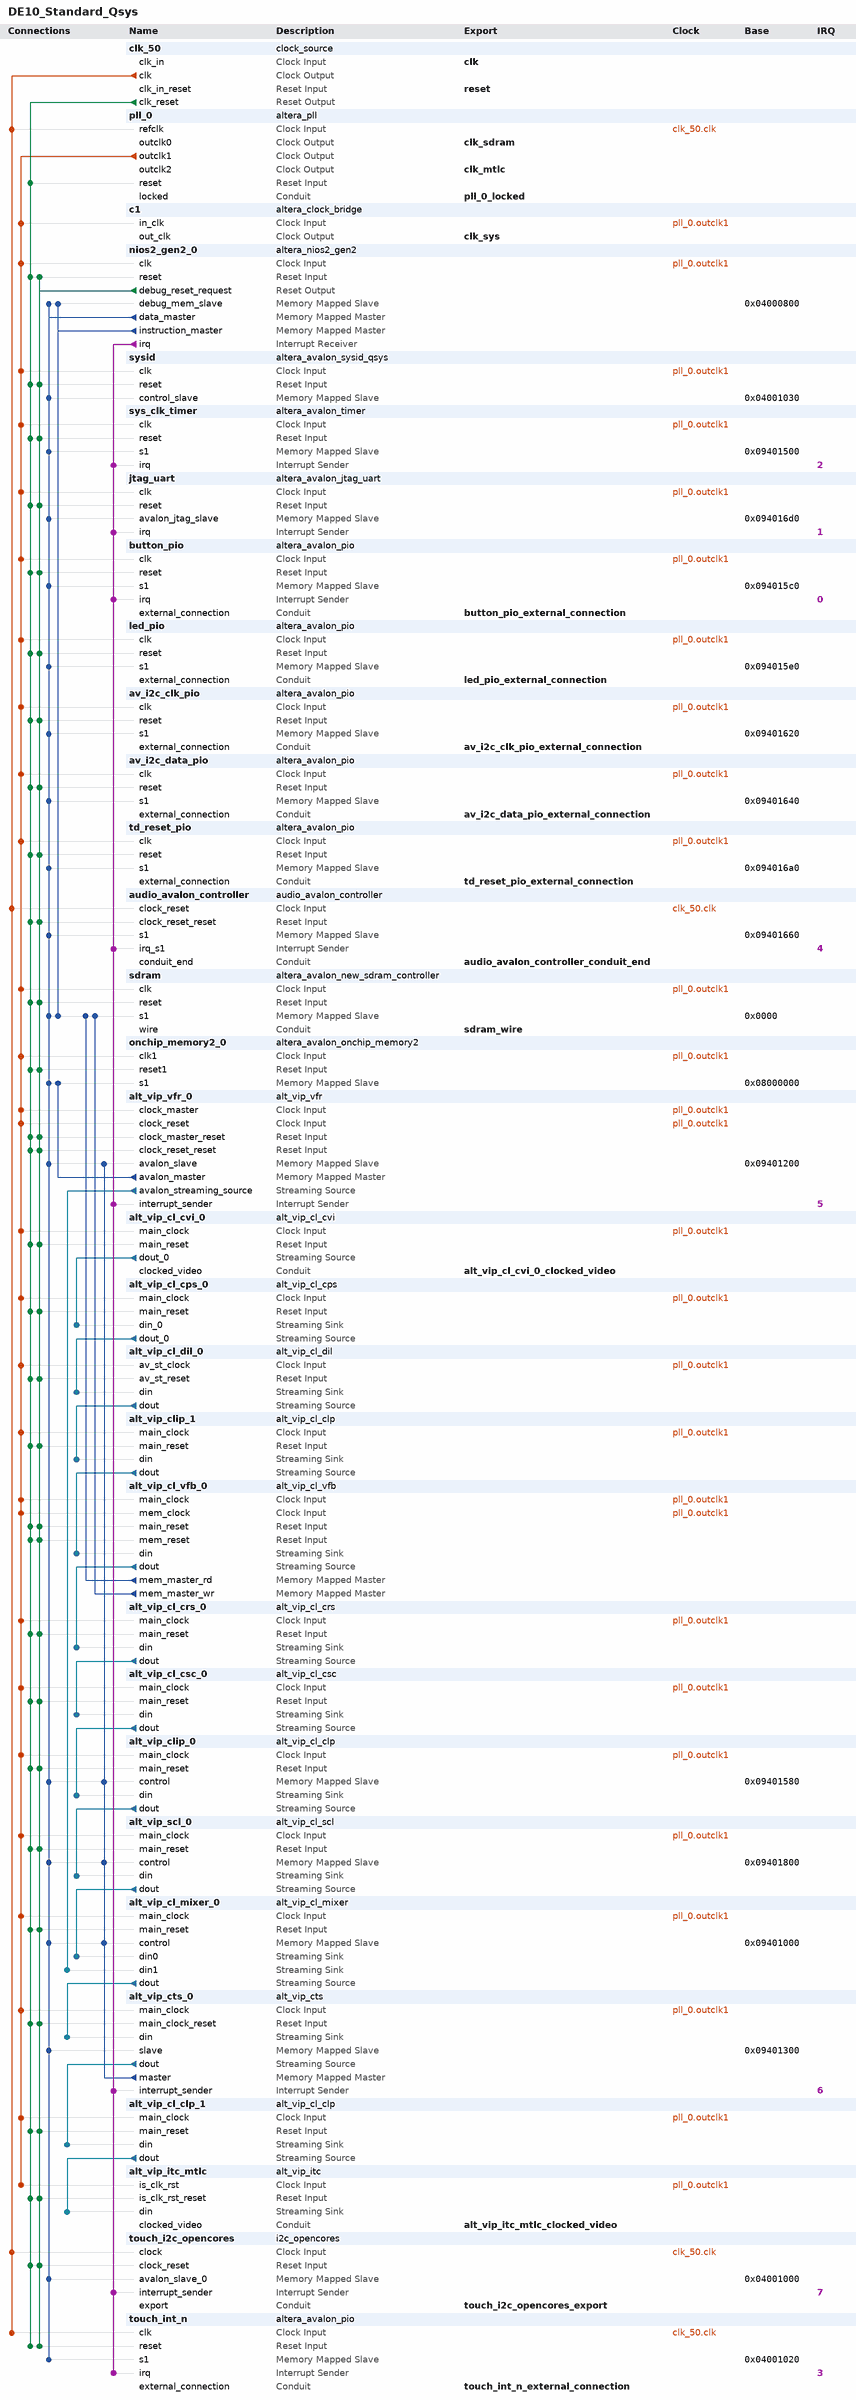
[diagram p0: system contents]
# Platform Designer (Qsys) system DE10_Standard_Qsys, Cyclone V 5CSXFC6D6F31C6
# Parameters at their usual value, and those the tool derives, are not listed.
package require -exact qsys 16.1
create_system DE10_Standard_Qsys
set_project_property DEVICE_FAMILY {Cyclone V}
set_project_property DEVICE 5CSXFC6D6F31C6

add_instance clk_50 clock_source 16.1
set_instance_parameter_value clk_50 clockFrequency 50000000

add_instance pll_0 altera_pll 16.1
set_instance_parameter_value pll_0 gui_device_speed_grade 1
set_instance_parameter_value pll_0 gui_number_of_clocks 3
set_instance_parameter_value pll_0 gui_operation_mode direct
set_instance_parameter_value pll_0 gui_output_clock_frequency0 120.0
set_instance_parameter_value pll_0 gui_output_clock_frequency1 120.0
set_instance_parameter_value pll_0 gui_output_clock_frequency2 33.33333
set_instance_parameter_value pll_0 gui_phase_shift0 -5100
set_instance_parameter_value pll_0 gui_pll_mode {Integer-N PLL}
set_instance_parameter_value pll_0 gui_reference_clock_frequency 50.0
set_instance_parameter_value pll_0 gui_use_locked true

add_instance c1 altera_clock_bridge 16.1
set_instance_parameter_value c1 DERIVED_CLOCK_RATE 120000000
set_instance_parameter_value c1 EXPLICIT_CLOCK_RATE 0

add_instance nios2_gen2_0 altera_nios2_gen2 16.1
set_instance_parameter_value nios2_gen2_0 dcache_size 0
set_instance_parameter_value nios2_gen2_0 exceptionSlave sdram.s1
set_instance_parameter_value nios2_gen2_0 icache_size 4096
set_instance_parameter_value nios2_gen2_0 impl Fast
set_instance_parameter_value nios2_gen2_0 resetSlave sdram.s1

add_instance sysid altera_avalon_sysid_qsys 16.1
set_instance_parameter_value sysid id 0

add_instance sys_clk_timer altera_avalon_timer 16.1
set_instance_parameter_value sys_clk_timer period 10.0
set_instance_parameter_value sys_clk_timer periodUnits MSEC

add_instance jtag_uart altera_avalon_jtag_uart 16.1
set_instance_parameter_value jtag_uart readBufferDepth 256
set_instance_parameter_value jtag_uart readIRQThreshold 4
set_instance_parameter_value jtag_uart simInteractiveOptions INTERACTIVE_ASCII_OUTPUT
set_instance_parameter_value jtag_uart writeBufferDepth 256
set_instance_parameter_value jtag_uart writeIRQThreshold 4

add_instance button_pio altera_avalon_pio 16.1
set_instance_parameter_value button_pio captureEdge true
set_instance_parameter_value button_pio direction Input
set_instance_parameter_value button_pio generateIRQ true
set_instance_parameter_value button_pio irqType EDGE
set_instance_parameter_value button_pio simDoTestBenchWiring true
set_instance_parameter_value button_pio simDrivenValue 15
set_instance_parameter_value button_pio width 4

add_instance led_pio altera_avalon_pio 16.1
set_instance_parameter_value led_pio direction Output
set_instance_parameter_value led_pio width 4

add_instance av_i2c_clk_pio altera_avalon_pio 16.1
set_instance_parameter_value av_i2c_clk_pio direction Output
set_instance_parameter_value av_i2c_clk_pio width 1

add_instance av_i2c_data_pio altera_avalon_pio 16.1
set_instance_parameter_value av_i2c_data_pio direction Bidir
set_instance_parameter_value av_i2c_data_pio simDoTestBenchWiring true
set_instance_parameter_value av_i2c_data_pio width 1

add_instance td_reset_pio altera_avalon_pio 16.1
set_instance_parameter_value td_reset_pio direction Output
set_instance_parameter_value td_reset_pio width 1

add_instance audio_avalon_controller audio_avalon_controller 2.0

add_instance sdram altera_avalon_new_sdram_controller 16.1
set_instance_parameter_value sdram TAC 5.5
set_instance_parameter_value sdram TRCD 20.0
set_instance_parameter_value sdram TRP 20.0
set_instance_parameter_value sdram casLatency 3
set_instance_parameter_value sdram columnWidth 10
set_instance_parameter_value sdram dataWidth 16
set_instance_parameter_value sdram generateSimulationModel true
set_instance_parameter_value sdram model custom
set_instance_parameter_value sdram numberOfBanks 4
set_instance_parameter_value sdram numberOfChipSelects 1
set_instance_parameter_value sdram powerUpDelay 100.0
set_instance_parameter_value sdram refreshPeriod 15.625
set_instance_parameter_value sdram rowWidth 13

add_instance onchip_memory2_0 altera_avalon_onchip_memory2 16.1
set_instance_parameter_value onchip_memory2_0 dataWidth 32
set_instance_parameter_value onchip_memory2_0 dualPort false
set_instance_parameter_value onchip_memory2_0 initMemContent true
set_instance_parameter_value onchip_memory2_0 initializationFileName onchip_mem.hex
set_instance_parameter_value onchip_memory2_0 memorySize 131072

add_instance alt_vip_vfr_0 alt_vip_vfr 14.0
set_instance_parameter_value alt_vip_vfr_0 CLOCKS_ARE_SEPARATE 0
set_instance_parameter_value alt_vip_vfr_0 MAX_IMAGE_HEIGHT 480
set_instance_parameter_value alt_vip_vfr_0 MAX_IMAGE_WIDTH 800
set_instance_parameter_value alt_vip_vfr_0 MEM_PORT_WIDTH 32
set_instance_parameter_value alt_vip_vfr_0 NUMBER_OF_CHANNELS_IN_PARALLEL 3
set_instance_parameter_value alt_vip_vfr_0 RMASTER_BURST_TARGET 64
set_instance_parameter_value alt_vip_vfr_0 RMASTER_FIFO_DEPTH 1024

add_instance alt_vip_cl_cvi_0 alt_vip_cl_cvi 16.1
set_instance_parameter_value alt_vip_cl_cvi_0 ACCEPT_COLOURS_IN_SEQ 0
set_instance_parameter_value alt_vip_cl_cvi_0 ANC_DEPTH 1
set_instance_parameter_value alt_vip_cl_cvi_0 BPS 8
set_instance_parameter_value alt_vip_cl_cvi_0 CLOCKS_ARE_SAME 0
set_instance_parameter_value alt_vip_cl_cvi_0 COLOUR_PLANES_ARE_IN_PARALLEL 0
set_instance_parameter_value alt_vip_cl_cvi_0 EXTRACT_TOTAL_RESOLUTION 1
set_instance_parameter_value alt_vip_cl_cvi_0 FIFO_DEPTH 2048
set_instance_parameter_value alt_vip_cl_cvi_0 GENERATE_ANC 0
set_instance_parameter_value alt_vip_cl_cvi_0 GENERATE_VID_F 0
set_instance_parameter_value alt_vip_cl_cvi_0 H_ACTIVE_PIXELS_F0 720
set_instance_parameter_value alt_vip_cl_cvi_0 INTERLACED 1
set_instance_parameter_value alt_vip_cl_cvi_0 MATCH_CTRLDATA_PKT_CLIP_BASIC 0
set_instance_parameter_value alt_vip_cl_cvi_0 MATCH_CTRLDATA_PKT_PAD_ADV 0
set_instance_parameter_value alt_vip_cl_cvi_0 NO_OF_CHANNELS 1
set_instance_parameter_value alt_vip_cl_cvi_0 NUMBER_OF_COLOUR_PLANES 2
set_instance_parameter_value alt_vip_cl_cvi_0 OVERFLOW_HANDLING 0
set_instance_parameter_value alt_vip_cl_cvi_0 PIXELS_IN_PARALLEL 1
set_instance_parameter_value alt_vip_cl_cvi_0 STD_WIDTH 1
set_instance_parameter_value alt_vip_cl_cvi_0 SYNC_TO 0
set_instance_parameter_value alt_vip_cl_cvi_0 USE_CONTROL 0
set_instance_parameter_value alt_vip_cl_cvi_0 USE_EMBEDDED_SYNCS 1
set_instance_parameter_value alt_vip_cl_cvi_0 USE_HDMI_DEPRICATION 0
set_instance_parameter_value alt_vip_cl_cvi_0 USE_STD 0
set_instance_parameter_value alt_vip_cl_cvi_0 V_ACTIVE_LINES_F0 288
set_instance_parameter_value alt_vip_cl_cvi_0 V_ACTIVE_LINES_F1 288

add_instance alt_vip_cl_cps_0 alt_vip_cl_cps 16.1
set_instance_parameter_value alt_vip_cl_cps_0 BITS_PER_SYMBOL 8
set_instance_parameter_value alt_vip_cl_cps_0 EXTRA_PIPELINING 0
set_instance_parameter_value alt_vip_cl_cps_0 INPUT_0_COLOR_PLANES_ARE_IN_PARALLEL 0
set_instance_parameter_value alt_vip_cl_cps_0 INPUT_0_FIFO 0
set_instance_parameter_value alt_vip_cl_cps_0 INPUT_0_FIFO_SIZE 128
set_instance_parameter_value alt_vip_cl_cps_0 INPUT_0_NUMBER_OF_COLOR_PLANES 2
set_instance_parameter_value alt_vip_cl_cps_0 INPUT_0_PATTERN C,Y
set_instance_parameter_value alt_vip_cl_cps_0 INPUT_0_PIXELS_IN_PARALLEL 1
set_instance_parameter_value alt_vip_cl_cps_0 INPUT_0_TWO_PIXELS_PATTERN 0
set_instance_parameter_value alt_vip_cl_cps_0 INPUT_1_COLOR_PLANES_ARE_IN_PARALLEL 1
set_instance_parameter_value alt_vip_cl_cps_0 INPUT_1_FIFO 0
set_instance_parameter_value alt_vip_cl_cps_0 INPUT_1_FIFO_SIZE 8
set_instance_parameter_value alt_vip_cl_cps_0 INPUT_1_NUMBER_OF_COLOR_PLANES 3
set_instance_parameter_value alt_vip_cl_cps_0 INPUT_1_PATTERN C0,C1,C2
set_instance_parameter_value alt_vip_cl_cps_0 INPUT_1_PIXELS_IN_PARALLEL 1
set_instance_parameter_value alt_vip_cl_cps_0 INPUT_1_TWO_PIXELS_PATTERN 0
set_instance_parameter_value alt_vip_cl_cps_0 INPUT_VALIDATION 1
set_instance_parameter_value alt_vip_cl_cps_0 NUMBER_OF_INPUTS 1
set_instance_parameter_value alt_vip_cl_cps_0 NUMBER_OF_OUTPUTS 1
set_instance_parameter_value alt_vip_cl_cps_0 OUTPUT_0_COLOR_PLANES_ARE_IN_PARALLEL 1
set_instance_parameter_value alt_vip_cl_cps_0 OUTPUT_0_FIFO 0
set_instance_parameter_value alt_vip_cl_cps_0 OUTPUT_0_FIFO_SIZE 128
set_instance_parameter_value alt_vip_cl_cps_0 OUTPUT_0_NUMBER_OF_COLOR_PLANES 2
set_instance_parameter_value alt_vip_cl_cps_0 OUTPUT_0_PATTERN C,Y
set_instance_parameter_value alt_vip_cl_cps_0 OUTPUT_0_PIXELS_IN_PARALLEL 1
set_instance_parameter_value alt_vip_cl_cps_0 OUTPUT_0_TWO_PIXELS_PATTERN 0
set_instance_parameter_value alt_vip_cl_cps_0 OUTPUT_1_COLOR_PLANES_ARE_IN_PARALLEL 1
set_instance_parameter_value alt_vip_cl_cps_0 OUTPUT_1_FIFO 0
set_instance_parameter_value alt_vip_cl_cps_0 OUTPUT_1_FIFO_SIZE 8
set_instance_parameter_value alt_vip_cl_cps_0 OUTPUT_1_NUMBER_OF_COLOR_PLANES 3
set_instance_parameter_value alt_vip_cl_cps_0 OUTPUT_1_PATTERN C0,C1,C2
set_instance_parameter_value alt_vip_cl_cps_0 OUTPUT_1_PIXELS_IN_PARALLEL 1
set_instance_parameter_value alt_vip_cl_cps_0 OUTPUT_1_TWO_PIXELS_PATTERN 0
set_instance_parameter_value alt_vip_cl_cps_0 OUTPUT_VALIDATION 1
set_instance_parameter_value alt_vip_cl_cps_0 USER_PACKET_SUPPORT PASSTHROUGH
set_instance_parameter_value alt_vip_cl_cps_0 USER_PKT_0_TO_0 1
set_instance_parameter_value alt_vip_cl_cps_0 USER_PKT_0_TO_1 0
set_instance_parameter_value alt_vip_cl_cps_0 USER_PKT_1_TO_0 0
set_instance_parameter_value alt_vip_cl_cps_0 USER_PKT_1_TO_1 1

add_instance alt_vip_cl_dil_0 alt_vip_cl_dil 16.1
set_instance_parameter_value alt_vip_cl_dil_0 BITS_PER_SYMBOL 8
set_instance_parameter_value alt_vip_cl_dil_0 BOB_BEHAVIOUR FRAME_FOR_FIELD
set_instance_parameter_value alt_vip_cl_dil_0 CADENCE_ALGORITHM_NAME CADENCE_32_22_VOF
set_instance_parameter_value alt_vip_cl_dil_0 CADENCE_DETECTION 0
set_instance_parameter_value alt_vip_cl_dil_0 CLOCKS_ARE_SEPARATE 0
set_instance_parameter_value alt_vip_cl_dil_0 COLOR_PLANES_ARE_IN_PARALLEL 1
set_instance_parameter_value alt_vip_cl_dil_0 DEINTERLACE_ALGORITHM BOB
set_instance_parameter_value alt_vip_cl_dil_0 DISABLE_EMBEDDED_STREAM_CLEANER 0
set_instance_parameter_value alt_vip_cl_dil_0 EDI_READ_MASTER_BURST_TARGET 32
set_instance_parameter_value alt_vip_cl_dil_0 EDI_READ_MASTER_FIFO_DEPTH 64
set_instance_parameter_value alt_vip_cl_dil_0 ENABLE_422_PROCESSING_FOR_INTERLACED_VIDEO 1
set_instance_parameter_value alt_vip_cl_dil_0 FAMILY {Cyclone V}
set_instance_parameter_value alt_vip_cl_dil_0 FIELD_LATENCY 0
set_instance_parameter_value alt_vip_cl_dil_0 IS_422 1
set_instance_parameter_value alt_vip_cl_dil_0 IS_YCBCR 1
set_instance_parameter_value alt_vip_cl_dil_0 MAX_HEIGHT 576
set_instance_parameter_value alt_vip_cl_dil_0 MAX_SYMBOLS_PER_PACKET 10
set_instance_parameter_value alt_vip_cl_dil_0 MAX_WIDTH 720
set_instance_parameter_value alt_vip_cl_dil_0 MA_READ_MASTER_BURST_TARGET 32
set_instance_parameter_value alt_vip_cl_dil_0 MA_READ_MASTER_FIFO_DEPTH 64
set_instance_parameter_value alt_vip_cl_dil_0 MEM_BASE_ADDR 0
set_instance_parameter_value alt_vip_cl_dil_0 MEM_PORT_WIDTH 256
set_instance_parameter_value alt_vip_cl_dil_0 MOTION_BLEED 1
set_instance_parameter_value alt_vip_cl_dil_0 MOTION_BPS 7
set_instance_parameter_value alt_vip_cl_dil_0 MOTION_READ_MASTER_BURST_TARGET 32
set_instance_parameter_value alt_vip_cl_dil_0 MOTION_READ_MASTER_FIFO_DEPTH 64
set_instance_parameter_value alt_vip_cl_dil_0 MOTION_WRITE_MASTER_BURST_TARGET 32
set_instance_parameter_value alt_vip_cl_dil_0 MOTION_WRITE_MASTER_FIFO_DEPTH 64
set_instance_parameter_value alt_vip_cl_dil_0 NUMBER_OF_COLOR_PLANES 2
set_instance_parameter_value alt_vip_cl_dil_0 PIXELS_IN_PARALLEL 1
set_instance_parameter_value alt_vip_cl_dil_0 RUNTIME_CONTROL 0
set_instance_parameter_value alt_vip_cl_dil_0 USER_PACKETS_MAX_STORAGE 0
set_instance_parameter_value alt_vip_cl_dil_0 USER_PACKET_FIFO_DEPTH 0
set_instance_parameter_value alt_vip_cl_dil_0 USER_PACKET_SUPPORT PASSTHROUGH
set_instance_parameter_value alt_vip_cl_dil_0 WRITE_MASTER_BURST_TARGET 32
set_instance_parameter_value alt_vip_cl_dil_0 WRITE_MASTER_FIFO_DEPTH 64

add_instance alt_vip_clip_1 alt_vip_cl_clp 16.1
set_instance_parameter_value alt_vip_clip_1 BITS_PER_SYMBOL 8
set_instance_parameter_value alt_vip_clip_1 BOTTOM_OFFSET 10
set_instance_parameter_value alt_vip_clip_1 CLIPPING_METHOD RECTANGLE
set_instance_parameter_value alt_vip_clip_1 COLOR_PLANES_ARE_IN_PARALLEL 1
set_instance_parameter_value alt_vip_clip_1 EXTRA_PIPELINING 0
set_instance_parameter_value alt_vip_clip_1 FAMILY {Cyclone V}
set_instance_parameter_value alt_vip_clip_1 LEFT_OFFSET 0
set_instance_parameter_value alt_vip_clip_1 LIMITED_READBACK 0
set_instance_parameter_value alt_vip_clip_1 MAX_IN_HEIGHT 576
set_instance_parameter_value alt_vip_clip_1 MAX_IN_WIDTH 720
set_instance_parameter_value alt_vip_clip_1 NUMBER_OF_COLOR_PLANES 2
set_instance_parameter_value alt_vip_clip_1 PIXELS_IN_PARALLEL 1
set_instance_parameter_value alt_vip_clip_1 RECTANGLE_HEIGHT 480
set_instance_parameter_value alt_vip_clip_1 RECTANGLE_WIDTH 720
set_instance_parameter_value alt_vip_clip_1 RIGHT_OFFSET 10
set_instance_parameter_value alt_vip_clip_1 RUNTIME_CONTROL 0
set_instance_parameter_value alt_vip_clip_1 TOP_OFFSET 24
set_instance_parameter_value alt_vip_clip_1 USER_PACKET_FIFO_DEPTH 0
set_instance_parameter_value alt_vip_clip_1 USER_PACKET_SUPPORT PASSTHROUGH

add_instance alt_vip_cl_vfb_0 alt_vip_cl_vfb 16.1
set_instance_parameter_value alt_vip_cl_vfb_0 CLOCKS_ARE_SEPARATE 1
set_instance_parameter_value alt_vip_cl_vfb_0 DROP_FRAMES 1
set_instance_parameter_value alt_vip_cl_vfb_0 DROP_INVALID_FIELDS 1
set_instance_parameter_value alt_vip_cl_vfb_0 DROP_REPEAT_USER 1
set_instance_parameter_value alt_vip_cl_vfb_0 IS_FRAME_READER 0
set_instance_parameter_value alt_vip_cl_vfb_0 MAX_HEIGHT 480
set_instance_parameter_value alt_vip_cl_vfb_0 MAX_WIDTH 720
set_instance_parameter_value alt_vip_cl_vfb_0 MEM_BASE_ADDR 16777216
set_instance_parameter_value alt_vip_cl_vfb_0 MEM_BUFFER_OFFSET 16777216
set_instance_parameter_value alt_vip_cl_vfb_0 MEM_PORT_WIDTH 32
set_instance_parameter_value alt_vip_cl_vfb_0 NUMBER_OF_COLOR_PLANES 2
set_instance_parameter_value alt_vip_cl_vfb_0 READER_RUNTIME_CONTROL 0
set_instance_parameter_value alt_vip_cl_vfb_0 READ_BURST_TARGET 64
set_instance_parameter_value alt_vip_cl_vfb_0 READ_FIFO_DEPTH 512
set_instance_parameter_value alt_vip_cl_vfb_0 USER_PACKETS_MAX_STORAGE 0
set_instance_parameter_value alt_vip_cl_vfb_0 USE_BUFFER_OFFSET 0
set_instance_parameter_value alt_vip_cl_vfb_0 WRITE_BURST_TARGET 64
set_instance_parameter_value alt_vip_cl_vfb_0 WRITE_FIFO_DEPTH 512

add_instance alt_vip_cl_crs_0 alt_vip_cl_crs 16.1
set_instance_parameter_value alt_vip_cl_crs_0 BITS_PER_SYMBOL 8
set_instance_parameter_value alt_vip_cl_crs_0 COLOR_PLANES_ARE_IN_PARALLEL 1
set_instance_parameter_value alt_vip_cl_crs_0 ENABLE_420_IN 0
set_instance_parameter_value alt_vip_cl_crs_0 ENABLE_420_OUT 0
set_instance_parameter_value alt_vip_cl_crs_0 ENABLE_422_IN 1
set_instance_parameter_value alt_vip_cl_crs_0 ENABLE_422_OUT 0
set_instance_parameter_value alt_vip_cl_crs_0 ENABLE_444_IN 0
set_instance_parameter_value alt_vip_cl_crs_0 ENABLE_444_OUT 1
set_instance_parameter_value alt_vip_cl_crs_0 HORIZ_ALGORITHM NEAREST_NEIGHBOUR
set_instance_parameter_value alt_vip_cl_crs_0 HORIZ_CO_SITING LEFT
set_instance_parameter_value alt_vip_cl_crs_0 HORIZ_ENABLE_LUMA_ADAPT 0
set_instance_parameter_value alt_vip_cl_crs_0 LIMITED_READBACK 0
set_instance_parameter_value alt_vip_cl_crs_0 MAX_HEIGHT 480
set_instance_parameter_value alt_vip_cl_crs_0 MAX_WIDTH 720
set_instance_parameter_value alt_vip_cl_crs_0 NUMBER_OF_COLOR_PLANES 2
set_instance_parameter_value alt_vip_cl_crs_0 PIPELINE_READY 0
set_instance_parameter_value alt_vip_cl_crs_0 PIP_IN 1
set_instance_parameter_value alt_vip_cl_crs_0 PIP_OUT 1
set_instance_parameter_value alt_vip_cl_crs_0 PIXELS_IN_PARALLEL 1
set_instance_parameter_value alt_vip_cl_crs_0 SHOW_HIDDEN_FEATURES 0
set_instance_parameter_value alt_vip_cl_crs_0 USER_PACKET_FIFO_DEPTH 0
set_instance_parameter_value alt_vip_cl_crs_0 USER_PACKET_SUPPORT PASSTHROUGH
set_instance_parameter_value alt_vip_cl_crs_0 VARIABLE_SIDE NEITHER
set_instance_parameter_value alt_vip_cl_crs_0 VERT_ALGORITHM BILINEAR
set_instance_parameter_value alt_vip_cl_crs_0 VERT_CO_SITING TOP
set_instance_parameter_value alt_vip_cl_crs_0 VERT_ENABLE_LUMA_ADAPT 0

add_instance alt_vip_cl_csc_0 alt_vip_cl_csc 16.1
set_instance_parameter_value alt_vip_cl_csc_0 COEFFICIENT_INT_BITS 2
set_instance_parameter_value alt_vip_cl_csc_0 COEFFICIENT_SIGNED 1
set_instance_parameter_value alt_vip_cl_csc_0 COEF_SUM_FRACTION_BITS 8
set_instance_parameter_value alt_vip_cl_csc_0 COLOR_PLANES_ARE_IN_PARALLEL 1
set_instance_parameter_value alt_vip_cl_csc_0 CONVERSION_MODE LSB
set_instance_parameter_value alt_vip_cl_csc_0 FAMILY {Cyclone V}
set_instance_parameter_value alt_vip_cl_csc_0 INPUT_BITS_PER_SYMBOL 8
set_instance_parameter_value alt_vip_cl_csc_0 INPUT_DATA_TYPE_GUARD_BAND 1
set_instance_parameter_value alt_vip_cl_csc_0 INPUT_DATA_TYPE_MAX 240
set_instance_parameter_value alt_vip_cl_csc_0 INPUT_DATA_TYPE_MIN 16
set_instance_parameter_value alt_vip_cl_csc_0 INPUT_DATA_TYPE_SIGNED 0
set_instance_parameter_value alt_vip_cl_csc_0 LIMITED_READBACK 0
set_instance_parameter_value alt_vip_cl_csc_0 MOVE_BINARY_POINT_RIGHT 0
set_instance_parameter_value alt_vip_cl_csc_0 NUMBER_OF_COLOR_PLANES 3
set_instance_parameter_value alt_vip_cl_csc_0 OUTPUT_BITS_PER_SYMBOL 8
set_instance_parameter_value alt_vip_cl_csc_0 OUTPUT_DATA_TYPE_GUARD_BAND 0
set_instance_parameter_value alt_vip_cl_csc_0 OUTPUT_DATA_TYPE_MAX 255
set_instance_parameter_value alt_vip_cl_csc_0 OUTPUT_DATA_TYPE_MIN 0
set_instance_parameter_value alt_vip_cl_csc_0 OUTPUT_DATA_TYPE_SIGNED 0
set_instance_parameter_value alt_vip_cl_csc_0 PIPELINE_DATA_OUTPUT 0
set_instance_parameter_value alt_vip_cl_csc_0 PIXELS_IN_PARALLEL 1
set_instance_parameter_value alt_vip_cl_csc_0 REMOVE_FRACTION_METHOD 1
set_instance_parameter_value alt_vip_cl_csc_0 REQ_FCOEFF_A0 2.018
set_instance_parameter_value alt_vip_cl_csc_0 REQ_FCOEFF_A1 -0.391
set_instance_parameter_value alt_vip_cl_csc_0 REQ_FCOEFF_A2 0.0
set_instance_parameter_value alt_vip_cl_csc_0 REQ_FCOEFF_B0 0.0
set_instance_parameter_value alt_vip_cl_csc_0 REQ_FCOEFF_B1 -0.813
set_instance_parameter_value alt_vip_cl_csc_0 REQ_FCOEFF_B2 1.596
set_instance_parameter_value alt_vip_cl_csc_0 REQ_FCOEFF_C0 1.164
set_instance_parameter_value alt_vip_cl_csc_0 REQ_FCOEFF_C1 1.164
set_instance_parameter_value alt_vip_cl_csc_0 REQ_FCOEFF_C2 1.164
set_instance_parameter_value alt_vip_cl_csc_0 REQ_FCOEFF_S0 -276.928
set_instance_parameter_value alt_vip_cl_csc_0 REQ_FCOEFF_S1 135.488
set_instance_parameter_value alt_vip_cl_csc_0 REQ_FCOEFF_S2 -222.912
set_instance_parameter_value alt_vip_cl_csc_0 RUNTIME_CONTROL 0
set_instance_parameter_value alt_vip_cl_csc_0 SIGN_TO_UNSIGN_METHOD 0
set_instance_parameter_value alt_vip_cl_csc_0 SUMMAND_INT_BITS 9
set_instance_parameter_value alt_vip_cl_csc_0 SUMMAND_SIGNED 1
set_instance_parameter_value alt_vip_cl_csc_0 USER_PACKET_SUPPORT PASSTHROUGH

add_instance alt_vip_clip_0 alt_vip_cl_clp 16.1
set_instance_parameter_value alt_vip_clip_0 BITS_PER_SYMBOL 8
set_instance_parameter_value alt_vip_clip_0 BOTTOM_OFFSET 10
set_instance_parameter_value alt_vip_clip_0 CLIPPING_METHOD RECTANGLE
set_instance_parameter_value alt_vip_clip_0 COLOR_PLANES_ARE_IN_PARALLEL 1
set_instance_parameter_value alt_vip_clip_0 EXTRA_PIPELINING 0
set_instance_parameter_value alt_vip_clip_0 FAMILY {Cyclone V}
set_instance_parameter_value alt_vip_clip_0 LEFT_OFFSET 0
set_instance_parameter_value alt_vip_clip_0 LIMITED_READBACK 0
set_instance_parameter_value alt_vip_clip_0 MAX_IN_HEIGHT 480
set_instance_parameter_value alt_vip_clip_0 MAX_IN_WIDTH 720
set_instance_parameter_value alt_vip_clip_0 NUMBER_OF_COLOR_PLANES 3
set_instance_parameter_value alt_vip_clip_0 PIXELS_IN_PARALLEL 1
set_instance_parameter_value alt_vip_clip_0 RECTANGLE_HEIGHT 480
set_instance_parameter_value alt_vip_clip_0 RECTANGLE_WIDTH 720
set_instance_parameter_value alt_vip_clip_0 RIGHT_OFFSET 10
set_instance_parameter_value alt_vip_clip_0 RUNTIME_CONTROL 1
set_instance_parameter_value alt_vip_clip_0 TOP_OFFSET 0
set_instance_parameter_value alt_vip_clip_0 USER_PACKET_FIFO_DEPTH 0
set_instance_parameter_value alt_vip_clip_0 USER_PACKET_SUPPORT PASSTHROUGH

add_instance alt_vip_scl_0 alt_vip_cl_scl 16.1
set_instance_parameter_value alt_vip_scl_0 ALGORITHM_NAME BILINEAR
set_instance_parameter_value alt_vip_scl_0 ALWAYS_DOWNSCALE 0
set_instance_parameter_value alt_vip_scl_0 ARE_IDENTICAL 0
set_instance_parameter_value alt_vip_scl_0 BITS_PER_SYMBOL 8
set_instance_parameter_value alt_vip_scl_0 DEFAULT_EDGE_THRESH 7
set_instance_parameter_value alt_vip_scl_0 DEFAULT_LOWER_BLUR 0
set_instance_parameter_value alt_vip_scl_0 DEFAULT_UPPER_BLUR 15
set_instance_parameter_value alt_vip_scl_0 ENABLE_FIR 0
set_instance_parameter_value alt_vip_scl_0 EXTRA_PIPELINING 0
set_instance_parameter_value alt_vip_scl_0 FAMILY {Cyclone V}
set_instance_parameter_value alt_vip_scl_0 H_BANKS 1
set_instance_parameter_value alt_vip_scl_0 H_COEFF_FILE {<enter file name (including full path)>}
set_instance_parameter_value alt_vip_scl_0 H_FRACTION_BITS 7
set_instance_parameter_value alt_vip_scl_0 H_FUNCTION LANCZOS_2
set_instance_parameter_value alt_vip_scl_0 H_INTEGER_BITS 1
set_instance_parameter_value alt_vip_scl_0 H_PHASES 16
set_instance_parameter_value alt_vip_scl_0 H_SIGNED 1
set_instance_parameter_value alt_vip_scl_0 H_SYMMETRIC 0
set_instance_parameter_value alt_vip_scl_0 H_TAPS 8
set_instance_parameter_value alt_vip_scl_0 IS_420 0
set_instance_parameter_value alt_vip_scl_0 IS_422 0
set_instance_parameter_value alt_vip_scl_0 LIMITED_READBACK 0
set_instance_parameter_value alt_vip_scl_0 LOAD_AT_RUNTIME 0
set_instance_parameter_value alt_vip_scl_0 MAX_IN_HEIGHT 480
set_instance_parameter_value alt_vip_scl_0 MAX_IN_WIDTH 720
set_instance_parameter_value alt_vip_scl_0 MAX_OUT_HEIGHT 480
set_instance_parameter_value alt_vip_scl_0 MAX_OUT_WIDTH 800
set_instance_parameter_value alt_vip_scl_0 NO_BLANKING 0
set_instance_parameter_value alt_vip_scl_0 PIXELS_IN_PARALLEL 1
set_instance_parameter_value alt_vip_scl_0 PRESERVE_BITS 0
set_instance_parameter_value alt_vip_scl_0 RUNTIME_CONTROL 1
set_instance_parameter_value alt_vip_scl_0 SYMBOLS_IN_PAR 3
set_instance_parameter_value alt_vip_scl_0 SYMBOLS_IN_SEQ 1
set_instance_parameter_value alt_vip_scl_0 USER_PACKET_FIFO_DEPTH 0
set_instance_parameter_value alt_vip_scl_0 USER_PACKET_SUPPORT PASSTHROUGH
set_instance_parameter_value alt_vip_scl_0 V_BANKS 1
set_instance_parameter_value alt_vip_scl_0 V_COEFF_FILE {<enter file name (including full path)>}
set_instance_parameter_value alt_vip_scl_0 V_FRACTION_BITS 7
set_instance_parameter_value alt_vip_scl_0 V_FUNCTION LANCZOS_2
set_instance_parameter_value alt_vip_scl_0 V_INTEGER_BITS 1
set_instance_parameter_value alt_vip_scl_0 V_PHASES 16
set_instance_parameter_value alt_vip_scl_0 V_SIGNED 1
set_instance_parameter_value alt_vip_scl_0 V_SYMMETRIC 0
set_instance_parameter_value alt_vip_scl_0 V_TAPS 8

add_instance alt_vip_cl_mixer_0 alt_vip_cl_mixer 16.1
set_instance_parameter_value alt_vip_cl_mixer_0 ALPHA_ENABLE 0
set_instance_parameter_value alt_vip_cl_mixer_0 ALPHA_STREAMS_ENABLE 0
set_instance_parameter_value alt_vip_cl_mixer_0 BITS_PER_SYMBOL 8
set_instance_parameter_value alt_vip_cl_mixer_0 COLOR_PLANES_ARE_IN_PARALLEL 1
set_instance_parameter_value alt_vip_cl_mixer_0 COLOR_SPACE RGB
set_instance_parameter_value alt_vip_cl_mixer_0 FAMILY {Cyclone V}
set_instance_parameter_value alt_vip_cl_mixer_0 IS_422 1
set_instance_parameter_value alt_vip_cl_mixer_0 LAYER_POSITION_ENABLE 0
set_instance_parameter_value alt_vip_cl_mixer_0 MAX_HEIGHT 480
set_instance_parameter_value alt_vip_cl_mixer_0 MAX_WIDTH 800
set_instance_parameter_value alt_vip_cl_mixer_0 NO_OF_INPUTS 2
set_instance_parameter_value alt_vip_cl_mixer_0 NUMBER_OF_COLOR_PLANES 2
set_instance_parameter_value alt_vip_cl_mixer_0 PATTERN uniform
set_instance_parameter_value alt_vip_cl_mixer_0 PIPELINE_READY 0
set_instance_parameter_value alt_vip_cl_mixer_0 PIXELS_IN_PARALLEL 1
set_instance_parameter_value alt_vip_cl_mixer_0 UNIFORM_VALUE_BCR 0
set_instance_parameter_value alt_vip_cl_mixer_0 UNIFORM_VALUE_GCB 0
set_instance_parameter_value alt_vip_cl_mixer_0 UNIFORM_VALUE_RY 0
set_instance_parameter_value alt_vip_cl_mixer_0 USER_PACKET_FIFO_DEPTH 0
set_instance_parameter_value alt_vip_cl_mixer_0 USER_PACKET_SUPPORT DISCARD

add_instance alt_vip_cts_0 alt_vip_cts 14.0
set_instance_parameter_value alt_vip_cts_0 BITS_PER_SYMBOL 8
set_instance_parameter_value alt_vip_cts_0 COLOUR_PLANES_ARE_IN_PARALLEL 1
set_instance_parameter_value alt_vip_cts_0 DISARM_ON_TRIGGER 1
set_instance_parameter_value alt_vip_cts_0 FAMILY {Cyclone V}
set_instance_parameter_value alt_vip_cts_0 MAX_INSTRUCTION_COUNT 10
set_instance_parameter_value alt_vip_cts_0 NUMBER_OF_COLOR_PLANES 3
set_instance_parameter_value alt_vip_cts_0 TRIGGER_ON_HEIGHT_CHANGE 0
set_instance_parameter_value alt_vip_cts_0 TRIGGER_ON_IMAGE_SOP 1
set_instance_parameter_value alt_vip_cts_0 TRIGGER_ON_WIDTH_CHANGE 0

add_instance alt_vip_cl_clp_1 alt_vip_cl_clp 16.1
set_instance_parameter_value alt_vip_cl_clp_1 BITS_PER_SYMBOL 8
set_instance_parameter_value alt_vip_cl_clp_1 BOTTOM_OFFSET 0
set_instance_parameter_value alt_vip_cl_clp_1 CLIPPING_METHOD RECTANGLE
set_instance_parameter_value alt_vip_cl_clp_1 COLOR_PLANES_ARE_IN_PARALLEL 1
set_instance_parameter_value alt_vip_cl_clp_1 EXTRA_PIPELINING 0
set_instance_parameter_value alt_vip_cl_clp_1 FAMILY {Cyclone V}
set_instance_parameter_value alt_vip_cl_clp_1 LEFT_OFFSET 0
set_instance_parameter_value alt_vip_cl_clp_1 LIMITED_READBACK 0
set_instance_parameter_value alt_vip_cl_clp_1 MAX_IN_HEIGHT 480
set_instance_parameter_value alt_vip_cl_clp_1 MAX_IN_WIDTH 800
set_instance_parameter_value alt_vip_cl_clp_1 NUMBER_OF_COLOR_PLANES 3
set_instance_parameter_value alt_vip_cl_clp_1 PIXELS_IN_PARALLEL 1
set_instance_parameter_value alt_vip_cl_clp_1 RECTANGLE_HEIGHT 480
set_instance_parameter_value alt_vip_cl_clp_1 RECTANGLE_WIDTH 800
set_instance_parameter_value alt_vip_cl_clp_1 RIGHT_OFFSET 0
set_instance_parameter_value alt_vip_cl_clp_1 RUNTIME_CONTROL 0
set_instance_parameter_value alt_vip_cl_clp_1 TOP_OFFSET 0
set_instance_parameter_value alt_vip_cl_clp_1 USER_PACKET_FIFO_DEPTH 0
set_instance_parameter_value alt_vip_cl_clp_1 USER_PACKET_SUPPORT PASSTHROUGH

add_instance alt_vip_itc_mtlc alt_vip_itc 14.0
set_instance_parameter_value alt_vip_itc_mtlc FIFO_DEPTH 8000
set_instance_parameter_value alt_vip_itc_mtlc H_ACTIVE_PIXELS 800
set_instance_parameter_value alt_vip_itc_mtlc H_BACK_PORCH 16
set_instance_parameter_value alt_vip_itc_mtlc H_FRONT_PORCH 210
set_instance_parameter_value alt_vip_itc_mtlc H_SYNC_LENGTH 30
set_instance_parameter_value alt_vip_itc_mtlc NUMBER_OF_COLOUR_PLANES 3
set_instance_parameter_value alt_vip_itc_mtlc THRESHOLD 4000
set_instance_parameter_value alt_vip_itc_mtlc V_ACTIVE_LINES 480
set_instance_parameter_value alt_vip_itc_mtlc V_BACK_PORCH 10
set_instance_parameter_value alt_vip_itc_mtlc V_FRONT_PORCH 22
set_instance_parameter_value alt_vip_itc_mtlc V_SYNC_LENGTH 13

add_instance touch_i2c_opencores i2c_opencores 12.0

add_instance touch_int_n altera_avalon_pio 16.1
set_instance_parameter_value touch_int_n captureEdge true
set_instance_parameter_value touch_int_n direction Input
set_instance_parameter_value touch_int_n edgeType FALLING
set_instance_parameter_value touch_int_n generateIRQ true
set_instance_parameter_value touch_int_n irqType EDGE
set_instance_parameter_value touch_int_n width 1

# connections
add_connection clk_50.clk audio_avalon_controller.clock_reset clock
add_connection clk_50.clk pll_0.refclk clock
add_connection clk_50.clk touch_i2c_opencores.clock clock
add_connection clk_50.clk touch_int_n.clk clock
add_connection pll_0.outclk1 alt_vip_cl_clp_1.main_clock clock
add_connection pll_0.outclk1 alt_vip_cl_cps_0.main_clock clock
add_connection pll_0.outclk1 alt_vip_cl_crs_0.main_clock clock
add_connection pll_0.outclk1 alt_vip_cl_csc_0.main_clock clock
add_connection pll_0.outclk1 alt_vip_cl_cvi_0.main_clock clock
add_connection pll_0.outclk1 alt_vip_cl_dil_0.av_st_clock clock
add_connection pll_0.outclk1 alt_vip_cl_mixer_0.main_clock clock
add_connection pll_0.outclk1 alt_vip_cl_vfb_0.main_clock clock
add_connection pll_0.outclk1 alt_vip_cl_vfb_0.mem_clock clock
add_connection pll_0.outclk1 alt_vip_clip_0.main_clock clock
add_connection pll_0.outclk1 alt_vip_clip_1.main_clock clock
add_connection pll_0.outclk1 alt_vip_cts_0.main_clock clock
add_connection pll_0.outclk1 alt_vip_itc_mtlc.is_clk_rst clock
add_connection pll_0.outclk1 alt_vip_scl_0.main_clock clock
add_connection pll_0.outclk1 alt_vip_vfr_0.clock_master clock
add_connection pll_0.outclk1 alt_vip_vfr_0.clock_reset clock
add_connection pll_0.outclk1 av_i2c_clk_pio.clk clock
add_connection pll_0.outclk1 av_i2c_data_pio.clk clock
add_connection pll_0.outclk1 button_pio.clk clock
add_connection pll_0.outclk1 c1.in_clk clock
add_connection pll_0.outclk1 jtag_uart.clk clock
add_connection pll_0.outclk1 led_pio.clk clock
add_connection pll_0.outclk1 nios2_gen2_0.clk clock
add_connection pll_0.outclk1 onchip_memory2_0.clk1 clock
add_connection pll_0.outclk1 sdram.clk clock
add_connection pll_0.outclk1 sys_clk_timer.clk clock
add_connection pll_0.outclk1 sysid.clk clock
add_connection pll_0.outclk1 td_reset_pio.clk clock
add_connection clk_50.clk_reset alt_vip_cl_clp_1.main_reset reset
add_connection clk_50.clk_reset alt_vip_cl_cps_0.main_reset reset
add_connection clk_50.clk_reset alt_vip_cl_crs_0.main_reset reset
add_connection clk_50.clk_reset alt_vip_cl_csc_0.main_reset reset
add_connection clk_50.clk_reset alt_vip_cl_cvi_0.main_reset reset
add_connection clk_50.clk_reset alt_vip_cl_dil_0.av_st_reset reset
add_connection clk_50.clk_reset alt_vip_cl_mixer_0.main_reset reset
add_connection clk_50.clk_reset alt_vip_cl_vfb_0.main_reset reset
add_connection clk_50.clk_reset alt_vip_cl_vfb_0.mem_reset reset
add_connection clk_50.clk_reset alt_vip_clip_0.main_reset reset
add_connection clk_50.clk_reset alt_vip_clip_1.main_reset reset
add_connection clk_50.clk_reset alt_vip_cts_0.main_clock_reset reset
add_connection clk_50.clk_reset alt_vip_itc_mtlc.is_clk_rst_reset reset
add_connection clk_50.clk_reset alt_vip_scl_0.main_reset reset
add_connection clk_50.clk_reset alt_vip_vfr_0.clock_master_reset reset
add_connection clk_50.clk_reset alt_vip_vfr_0.clock_reset_reset reset
add_connection clk_50.clk_reset audio_avalon_controller.clock_reset_reset reset
add_connection clk_50.clk_reset av_i2c_clk_pio.reset reset
add_connection clk_50.clk_reset av_i2c_data_pio.reset reset
add_connection clk_50.clk_reset button_pio.reset reset
add_connection clk_50.clk_reset jtag_uart.reset reset
add_connection clk_50.clk_reset led_pio.reset reset
add_connection clk_50.clk_reset nios2_gen2_0.reset reset
add_connection clk_50.clk_reset onchip_memory2_0.reset1 reset
add_connection clk_50.clk_reset pll_0.reset reset
add_connection clk_50.clk_reset sdram.reset reset
add_connection clk_50.clk_reset sys_clk_timer.reset reset
add_connection clk_50.clk_reset sysid.reset reset
add_connection clk_50.clk_reset td_reset_pio.reset reset
add_connection clk_50.clk_reset touch_i2c_opencores.clock_reset reset
add_connection clk_50.clk_reset touch_int_n.reset reset
add_connection nios2_gen2_0.debug_reset_request alt_vip_cl_clp_1.main_reset reset
add_connection nios2_gen2_0.debug_reset_request alt_vip_cl_cps_0.main_reset reset
add_connection nios2_gen2_0.debug_reset_request alt_vip_cl_crs_0.main_reset reset
add_connection nios2_gen2_0.debug_reset_request alt_vip_cl_csc_0.main_reset reset
add_connection nios2_gen2_0.debug_reset_request alt_vip_cl_cvi_0.main_reset reset
add_connection nios2_gen2_0.debug_reset_request alt_vip_cl_dil_0.av_st_reset reset
add_connection nios2_gen2_0.debug_reset_request alt_vip_cl_mixer_0.main_reset reset
add_connection nios2_gen2_0.debug_reset_request alt_vip_cl_vfb_0.main_reset reset
add_connection nios2_gen2_0.debug_reset_request alt_vip_cl_vfb_0.mem_reset reset
add_connection nios2_gen2_0.debug_reset_request alt_vip_clip_0.main_reset reset
add_connection nios2_gen2_0.debug_reset_request alt_vip_clip_1.main_reset reset
add_connection nios2_gen2_0.debug_reset_request alt_vip_cts_0.main_clock_reset reset
add_connection nios2_gen2_0.debug_reset_request alt_vip_itc_mtlc.is_clk_rst_reset reset
add_connection nios2_gen2_0.debug_reset_request alt_vip_scl_0.main_reset reset
add_connection nios2_gen2_0.debug_reset_request alt_vip_vfr_0.clock_master_reset reset
add_connection nios2_gen2_0.debug_reset_request alt_vip_vfr_0.clock_reset_reset reset
add_connection nios2_gen2_0.debug_reset_request audio_avalon_controller.clock_reset_reset reset
add_connection nios2_gen2_0.debug_reset_request av_i2c_clk_pio.reset reset
add_connection nios2_gen2_0.debug_reset_request av_i2c_data_pio.reset reset
add_connection nios2_gen2_0.debug_reset_request button_pio.reset reset
add_connection nios2_gen2_0.debug_reset_request jtag_uart.reset reset
add_connection nios2_gen2_0.debug_reset_request led_pio.reset reset
add_connection nios2_gen2_0.debug_reset_request nios2_gen2_0.reset reset
add_connection nios2_gen2_0.debug_reset_request onchip_memory2_0.reset1 reset
add_connection nios2_gen2_0.debug_reset_request sdram.reset reset
add_connection nios2_gen2_0.debug_reset_request sys_clk_timer.reset reset
add_connection nios2_gen2_0.debug_reset_request sysid.reset reset
add_connection nios2_gen2_0.debug_reset_request td_reset_pio.reset reset
add_connection nios2_gen2_0.debug_reset_request touch_i2c_opencores.clock_reset reset
add_connection nios2_gen2_0.debug_reset_request touch_int_n.reset reset
add_connection alt_vip_cl_vfb_0.mem_master_rd sdram.s1 avalon
set_connection_parameter_value alt_vip_cl_vfb_0.mem_master_rd/sdram.s1 arbitrationPriority 20
set_connection_parameter_value alt_vip_cl_vfb_0.mem_master_rd/sdram.s1 baseAddress 0x0000
add_connection alt_vip_cl_vfb_0.mem_master_wr sdram.s1 avalon
set_connection_parameter_value alt_vip_cl_vfb_0.mem_master_wr/sdram.s1 arbitrationPriority 20
set_connection_parameter_value alt_vip_cl_vfb_0.mem_master_wr/sdram.s1 baseAddress 0x0000
add_connection alt_vip_cts_0.master alt_vip_cl_mixer_0.control avalon
set_connection_parameter_value alt_vip_cts_0.master/alt_vip_cl_mixer_0.control baseAddress 0x09401000
add_connection alt_vip_cts_0.master alt_vip_clip_0.control avalon
set_connection_parameter_value alt_vip_cts_0.master/alt_vip_clip_0.control baseAddress 0x09401580
add_connection alt_vip_cts_0.master alt_vip_scl_0.control avalon
set_connection_parameter_value alt_vip_cts_0.master/alt_vip_scl_0.control baseAddress 0x09401800
add_connection alt_vip_cts_0.master alt_vip_vfr_0.avalon_slave avalon
set_connection_parameter_value alt_vip_cts_0.master/alt_vip_vfr_0.avalon_slave baseAddress 0x09401200
add_connection alt_vip_vfr_0.avalon_master onchip_memory2_0.s1 avalon
set_connection_parameter_value alt_vip_vfr_0.avalon_master/onchip_memory2_0.s1 baseAddress 0x08000000
add_connection nios2_gen2_0.data_master alt_vip_cl_mixer_0.control avalon
set_connection_parameter_value nios2_gen2_0.data_master/alt_vip_cl_mixer_0.control baseAddress 0x09401000
add_connection nios2_gen2_0.data_master alt_vip_clip_0.control avalon
set_connection_parameter_value nios2_gen2_0.data_master/alt_vip_clip_0.control baseAddress 0x09401580
add_connection nios2_gen2_0.data_master alt_vip_cts_0.slave avalon
set_connection_parameter_value nios2_gen2_0.data_master/alt_vip_cts_0.slave baseAddress 0x09401300
add_connection nios2_gen2_0.data_master alt_vip_scl_0.control avalon
set_connection_parameter_value nios2_gen2_0.data_master/alt_vip_scl_0.control baseAddress 0x09401800
add_connection nios2_gen2_0.data_master alt_vip_vfr_0.avalon_slave avalon
set_connection_parameter_value nios2_gen2_0.data_master/alt_vip_vfr_0.avalon_slave baseAddress 0x09401200
add_connection nios2_gen2_0.data_master audio_avalon_controller.s1 avalon
set_connection_parameter_value nios2_gen2_0.data_master/audio_avalon_controller.s1 baseAddress 0x09401660
add_connection nios2_gen2_0.data_master av_i2c_clk_pio.s1 avalon
set_connection_parameter_value nios2_gen2_0.data_master/av_i2c_clk_pio.s1 baseAddress 0x09401620
add_connection nios2_gen2_0.data_master av_i2c_data_pio.s1 avalon
set_connection_parameter_value nios2_gen2_0.data_master/av_i2c_data_pio.s1 baseAddress 0x09401640
add_connection nios2_gen2_0.data_master button_pio.s1 avalon
set_connection_parameter_value nios2_gen2_0.data_master/button_pio.s1 baseAddress 0x094015c0
add_connection nios2_gen2_0.data_master jtag_uart.avalon_jtag_slave avalon
set_connection_parameter_value nios2_gen2_0.data_master/jtag_uart.avalon_jtag_slave baseAddress 0x094016d0
add_connection nios2_gen2_0.data_master led_pio.s1 avalon
set_connection_parameter_value nios2_gen2_0.data_master/led_pio.s1 baseAddress 0x094015e0
add_connection nios2_gen2_0.data_master nios2_gen2_0.debug_mem_slave avalon
set_connection_parameter_value nios2_gen2_0.data_master/nios2_gen2_0.debug_mem_slave baseAddress 0x04000800
add_connection nios2_gen2_0.data_master onchip_memory2_0.s1 avalon
set_connection_parameter_value nios2_gen2_0.data_master/onchip_memory2_0.s1 baseAddress 0x08000000
add_connection nios2_gen2_0.data_master sdram.s1 avalon
set_connection_parameter_value nios2_gen2_0.data_master/sdram.s1 arbitrationPriority 5
set_connection_parameter_value nios2_gen2_0.data_master/sdram.s1 baseAddress 0x0000
add_connection nios2_gen2_0.data_master sys_clk_timer.s1 avalon
set_connection_parameter_value nios2_gen2_0.data_master/sys_clk_timer.s1 baseAddress 0x09401500
add_connection nios2_gen2_0.data_master sysid.control_slave avalon
set_connection_parameter_value nios2_gen2_0.data_master/sysid.control_slave baseAddress 0x04001030
add_connection nios2_gen2_0.data_master td_reset_pio.s1 avalon
set_connection_parameter_value nios2_gen2_0.data_master/td_reset_pio.s1 baseAddress 0x094016a0
add_connection nios2_gen2_0.data_master touch_i2c_opencores.avalon_slave_0 avalon
set_connection_parameter_value nios2_gen2_0.data_master/touch_i2c_opencores.avalon_slave_0 baseAddress 0x04001000
add_connection nios2_gen2_0.data_master touch_int_n.s1 avalon
set_connection_parameter_value nios2_gen2_0.data_master/touch_int_n.s1 baseAddress 0x04001020
add_connection nios2_gen2_0.instruction_master nios2_gen2_0.debug_mem_slave avalon
set_connection_parameter_value nios2_gen2_0.instruction_master/nios2_gen2_0.debug_mem_slave baseAddress 0x04000800
add_connection nios2_gen2_0.instruction_master sdram.s1 avalon
set_connection_parameter_value nios2_gen2_0.instruction_master/sdram.s1 arbitrationPriority 5
set_connection_parameter_value nios2_gen2_0.instruction_master/sdram.s1 baseAddress 0x0000
add_connection alt_vip_cl_clp_1.dout alt_vip_itc_mtlc.din avalon_streaming
add_connection alt_vip_cl_cps_0.dout_0 alt_vip_cl_dil_0.din avalon_streaming
add_connection alt_vip_cl_crs_0.dout alt_vip_cl_csc_0.din avalon_streaming
add_connection alt_vip_cl_csc_0.dout alt_vip_clip_0.din avalon_streaming
add_connection alt_vip_cl_cvi_0.dout_0 alt_vip_cl_cps_0.din_0 avalon_streaming
add_connection alt_vip_cl_dil_0.dout alt_vip_clip_1.din avalon_streaming
add_connection alt_vip_cl_mixer_0.dout alt_vip_cts_0.din avalon_streaming
add_connection alt_vip_cl_vfb_0.dout alt_vip_cl_crs_0.din avalon_streaming
add_connection alt_vip_clip_0.dout alt_vip_scl_0.din avalon_streaming
add_connection alt_vip_clip_1.dout alt_vip_cl_vfb_0.din avalon_streaming
add_connection alt_vip_cts_0.dout alt_vip_cl_clp_1.din avalon_streaming
add_connection alt_vip_scl_0.dout alt_vip_cl_mixer_0.din0 avalon_streaming
add_connection alt_vip_vfr_0.avalon_streaming_source alt_vip_cl_mixer_0.din1 avalon_streaming
add_connection nios2_gen2_0.irq alt_vip_cts_0.interrupt_sender interrupt
set_connection_parameter_value nios2_gen2_0.irq/alt_vip_cts_0.interrupt_sender irqNumber 6
add_connection nios2_gen2_0.irq alt_vip_vfr_0.interrupt_sender interrupt
set_connection_parameter_value nios2_gen2_0.irq/alt_vip_vfr_0.interrupt_sender irqNumber 5
add_connection nios2_gen2_0.irq audio_avalon_controller.irq_s1 interrupt
set_connection_parameter_value nios2_gen2_0.irq/audio_avalon_controller.irq_s1 irqNumber 4
add_connection nios2_gen2_0.irq button_pio.irq interrupt
set_connection_parameter_value nios2_gen2_0.irq/button_pio.irq irqNumber 0
add_connection nios2_gen2_0.irq jtag_uart.irq interrupt
set_connection_parameter_value nios2_gen2_0.irq/jtag_uart.irq irqNumber 1
add_connection nios2_gen2_0.irq sys_clk_timer.irq interrupt
set_connection_parameter_value nios2_gen2_0.irq/sys_clk_timer.irq irqNumber 2
add_connection nios2_gen2_0.irq touch_i2c_opencores.interrupt_sender interrupt
set_connection_parameter_value nios2_gen2_0.irq/touch_i2c_opencores.interrupt_sender irqNumber 7
add_connection nios2_gen2_0.irq touch_int_n.irq interrupt
set_connection_parameter_value nios2_gen2_0.irq/touch_int_n.irq irqNumber 3

# exported interfaces
add_interface alt_vip_cl_cvi_0_clocked_video conduit end
set_interface_property alt_vip_cl_cvi_0_clocked_video EXPORT_OF alt_vip_cl_cvi_0.clocked_video
add_interface alt_vip_itc_mtlc_clocked_video conduit end
set_interface_property alt_vip_itc_mtlc_clocked_video EXPORT_OF alt_vip_itc_mtlc.clocked_video
add_interface audio_avalon_controller_conduit_end conduit end
set_interface_property audio_avalon_controller_conduit_end EXPORT_OF audio_avalon_controller.conduit_end
add_interface av_i2c_clk_pio_external_connection conduit end
set_interface_property av_i2c_clk_pio_external_connection EXPORT_OF av_i2c_clk_pio.external_connection
add_interface av_i2c_data_pio_external_connection conduit end
set_interface_property av_i2c_data_pio_external_connection EXPORT_OF av_i2c_data_pio.external_connection
add_interface button_pio_external_connection conduit end
set_interface_property button_pio_external_connection EXPORT_OF button_pio.external_connection
add_interface clk clock sink
set_interface_property clk EXPORT_OF clk_50.clk_in
add_interface clk_mtlc clock source
set_interface_property clk_mtlc EXPORT_OF pll_0.outclk2
add_interface clk_sdram clock source
set_interface_property clk_sdram EXPORT_OF pll_0.outclk0
add_interface clk_sys clock source
set_interface_property clk_sys EXPORT_OF c1.out_clk
add_interface led_pio_external_connection conduit end
set_interface_property led_pio_external_connection EXPORT_OF led_pio.external_connection
add_interface pll_0_locked conduit end
set_interface_property pll_0_locked EXPORT_OF pll_0.locked
add_interface reset reset sink
set_interface_property reset EXPORT_OF clk_50.clk_in_reset
add_interface sdram_wire conduit end
set_interface_property sdram_wire EXPORT_OF sdram.wire
add_interface td_reset_pio_external_connection conduit end
set_interface_property td_reset_pio_external_connection EXPORT_OF td_reset_pio.external_connection
add_interface touch_i2c_opencores_export conduit end
set_interface_property touch_i2c_opencores_export EXPORT_OF touch_i2c_opencores.export
add_interface touch_int_n_external_connection conduit end
set_interface_property touch_int_n_external_connection EXPORT_OF touch_int_n.external_connection

set_interconnect_requirement {$system} qsys_mm.clockCrossingAdapter HANDSHAKE
set_interconnect_requirement {$system} qsys_mm.maxAdditionalLatency 0

save_system DE10_Standard_Qsys.qsys
